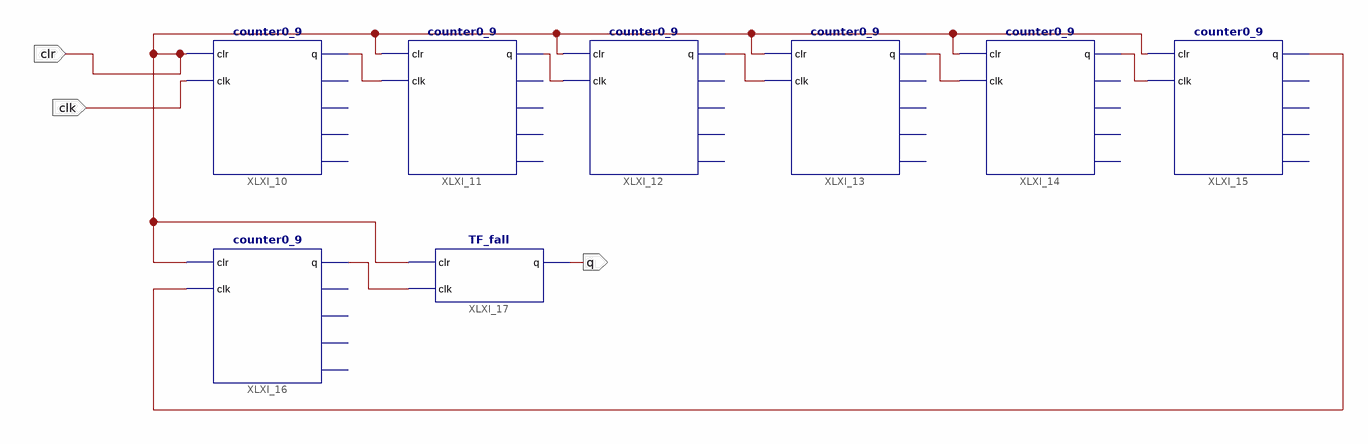
[diagram p0: schematic sheet 1]
// Xilinx ISE schematic counter0_20M.sch (spartan6) as structural Verilog: 8 symbols, 3 ports
module counter0_20M (
  input  clr,
  input  clk,
  output q
);

  wire XLXN_31, XLXN_32, XLXN_33, XLXN_34, XLXN_35, XLXN_36, XLXN_37;

  counter0_9 XLXI_10 (.clk(clk), .clr(clr), .q(XLXN_31));  // open: bit0, bit1, bit2, bit3
  counter0_9 XLXI_11 (.clk(XLXN_31), .clr(clr), .q(XLXN_32));  // open: bit0, bit1, bit2, bit3
  counter0_9 XLXI_12 (.clk(XLXN_32), .clr(clr), .q(XLXN_33));  // open: bit0, bit1, bit2, bit3
  counter0_9 XLXI_13 (.clk(XLXN_33), .clr(clr), .q(XLXN_34));  // open: bit0, bit1, bit2, bit3
  counter0_9 XLXI_14 (.clk(XLXN_34), .clr(clr), .q(XLXN_35));  // open: bit0, bit1, bit2, bit3
  counter0_9 XLXI_15 (.clk(XLXN_35), .clr(clr), .q(XLXN_36));  // open: bit0, bit1, bit2, bit3
  counter0_9 XLXI_16 (.clk(XLXN_36), .clr(clr), .q(XLXN_37));  // open: bit0, bit1, bit2, bit3
  TF_fall XLXI_17 (.clr(clr), .clk(XLXN_37), .q(q));
endmodule
